# Altium project PCB_Project1.PrjPCB
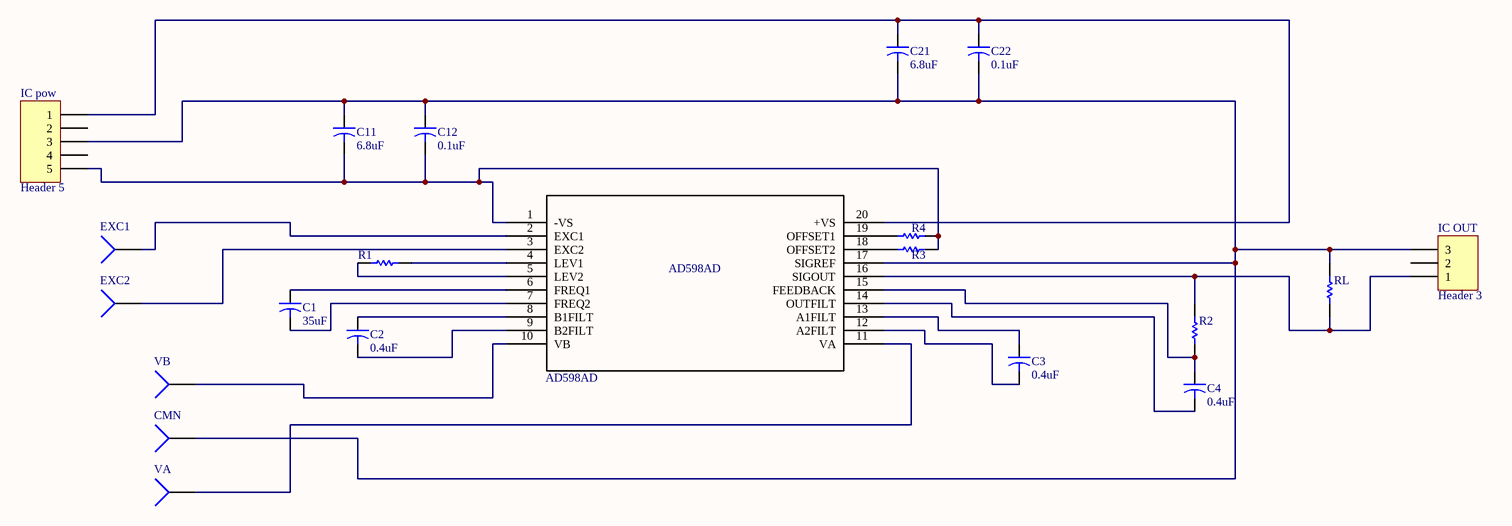
[diagram p0: Sheet2.SchDoc]
1 sheet, 21 parts. Net scope: global (net labels, ports and power ports of the same name join across sheets).
Board file: PCB1.PcbDoc

## Sheet Sheet2.SchDoc
size A4

### Parts
AD598AD  AD598AD  [D_20]
C1  value 35uF  [CAPR5-4X5]  (hidden comment: Cap2)
C2  value 0.4uF  [CAPR5-4X5]  (hidden comment: Cap2)
C3  value 0.4uF  [CAPR5-4X5]  (hidden comment: Cap2)
C4  value 0.4uF  [CAPR5-4X5]  (hidden comment: Cap2)
C11  value 6.8uF  [CAPR5-4X5]  (hidden comment: Cap2)
C12  value 0.1uF  [CAPR5-4X5]  (hidden comment: Cap2)
C21  value 6.8uF  [CAPR5-4X5]  (hidden comment: Cap2)
C22  value 0.1uF  [CAPR5-4X5]  (hidden comment: Cap2)
CMN  Socket  [PIN1]  (value not drawn)
EXC1  Socket  [PIN1]  (value not drawn)
EXC2  Socket  [PIN1]  (value not drawn)
IC_OUT  Header 3  [HDR1X3]
IC_pow  Header 5  [HDR1X5]
R1  R1  [AXIAL-0.3]  (value not drawn)
R2  Res1  [AXIAL-0.3]  (value not drawn)
R3  Res1  [AXIAL-0.3]  (value not drawn)
R4  Res1  [AXIAL-0.3]  (value not drawn)
RL  Res1  [AXIAL-0.3]  (value not drawn)
VA  Socket  [PIN1]  (value not drawn)
VB  Socket  [PIN1]  (value not drawn)

### Nets
NetAD598AD_1: AD598AD.1(-VS) C11.2 C12.2 IC_pow.5 R3.2 R4.2
NetAD598AD_2: AD598AD.2(EXC1) EXC1.1
NetAD598AD_3: AD598AD.3(EXC2) EXC2.1
NetAD598AD_4: AD598AD.4(LEV1) R1.1
NetAD598AD_5: AD598AD.5(LEV2) R1.2
NetAD598AD_6: AD598AD.6(FREQ1) C1.1
NetAD598AD_7: AD598AD.7(FREQ2) C1.2
NetAD598AD_8: AD598AD.8(B1FILT) C2.1
NetAD598AD_9: AD598AD.9(B2FILT) C2.2
NetAD598AD_10: AD598AD.10(VB) VB.1
NetAD598AD_11: AD598AD.11(VA) VA.1
NetAD598AD_12: AD598AD.12(A2FILT) C3.2
NetAD598AD_13: AD598AD.13(A1FILT) C3.1
NetAD598AD_14: AD598AD.14(OUTFILT) C4.2
NetAD598AD_15: AD598AD.15(FEEDBACK) C4.1 R2.1
NetAD598AD_16: AD598AD.16(SIGOUT) IC_OUT.1 R2.2 RL.1
NetAD598AD_17: AD598AD.17(SIGREF) C11.1 C12.1 C21.2 C22.2 CMN.1 IC_OUT.3 IC_pow.3 RL.2
NetAD598AD_18: AD598AD.18(OFFSET2) R3.1
NetAD598AD_19: AD598AD.19(OFFSET1) R4.1
NetAD598AD_20: AD598AD.20(+VS) C21.1 C22.1 IC_pow.1

Not connected (* = marked no-connect by the designer): IC_OUT 2; IC_pow 2 4

### Library data of the parts
AD598AD = AD598AD: Imported; RefDes: RefDes; Type: DEV; Value: Value
C1-C4 C11 C12 C21 C22 = Cap2: Capacitor; Published: 23-Sep-2002; PackageReference: CAPR5-4X5; Publisher: Altium Limited; PackageDescription: Capacitor; 2 Leads
IC_OUT = Header 3: Header, 3-Pin; LatestRevisionDate: 17-Jul-2002; LatestRevisionNote: Re-released for DXP Platform.; Publisher: Altium Limited
IC_pow = Header 5: Header, 5-Pin; LatestRevisionDate: 17-Jul-2002; LatestRevisionNote: Re-released for DXP Platform.; Publisher: Altium Limited
R1-R4 RL = Res1: Resistor; Value: 1K; Published: 8-Jun-2000; LatestRevisionDate: 17-Jul-2002; LatestRevisionNote: Re-released for DXP Platform.; PackageReference: AXIAL-0.3; Publisher: Altium Limited; PackageDescription: Axial Device, Thru-Hole; 2 Leads; 0.3 in Pin Spacing
CMN EXC1 EXC2 VA VB = Socket: LatestRevisionDate: 17-Jul-2002; LatestRevisionNote: Re-released for DXP Platform.; Publisher: Altium Limited